# Altium schematic sheet BLDC-CONNECTORS.SchDoc
size 420 x 297 mm; DocumentNumber: АБВГ.000000.000 Э3; SheetNumber: 5; PageSetup: Record=PageOptions|CenterHorizontal=False|CenterVertical=False|PrintScale=0.95|XCorrection=0.00|YCorrection=0.00|PrintKind=1|BorderSize=5000000|LeftOffset=0|BottomOffset=0|Orientation=1|PaperLength=1000|PaperWidth=1000|Scale=100|PaperSource=15|PrintQuality=600|MediaType=1|DitherType=10|PaperKind=A4|PrintScaleMode=1; Letter1Column: {}; Letter2Column: {}; Letter3Column: {}; ProcessInspection: ProcessInspection; EngineerName: EngineerName; NormInspection: NormInspection; DocumentType: DocumentType; Mass: Mass; Scale: Scale; Developer1size1str: Developer1size1str; Developer2size1str: Developer2size1str; Developer2size2str: Developer2size2str; Title1size1str: Title1size1str; Title2size1str: Title2size1str; Title2size2str: Title2size2str; Title3size3str: Title3size3str; Title3size2str: Title3size2str; Title3size1str: Title3size1str; FunctionalGroup: #_
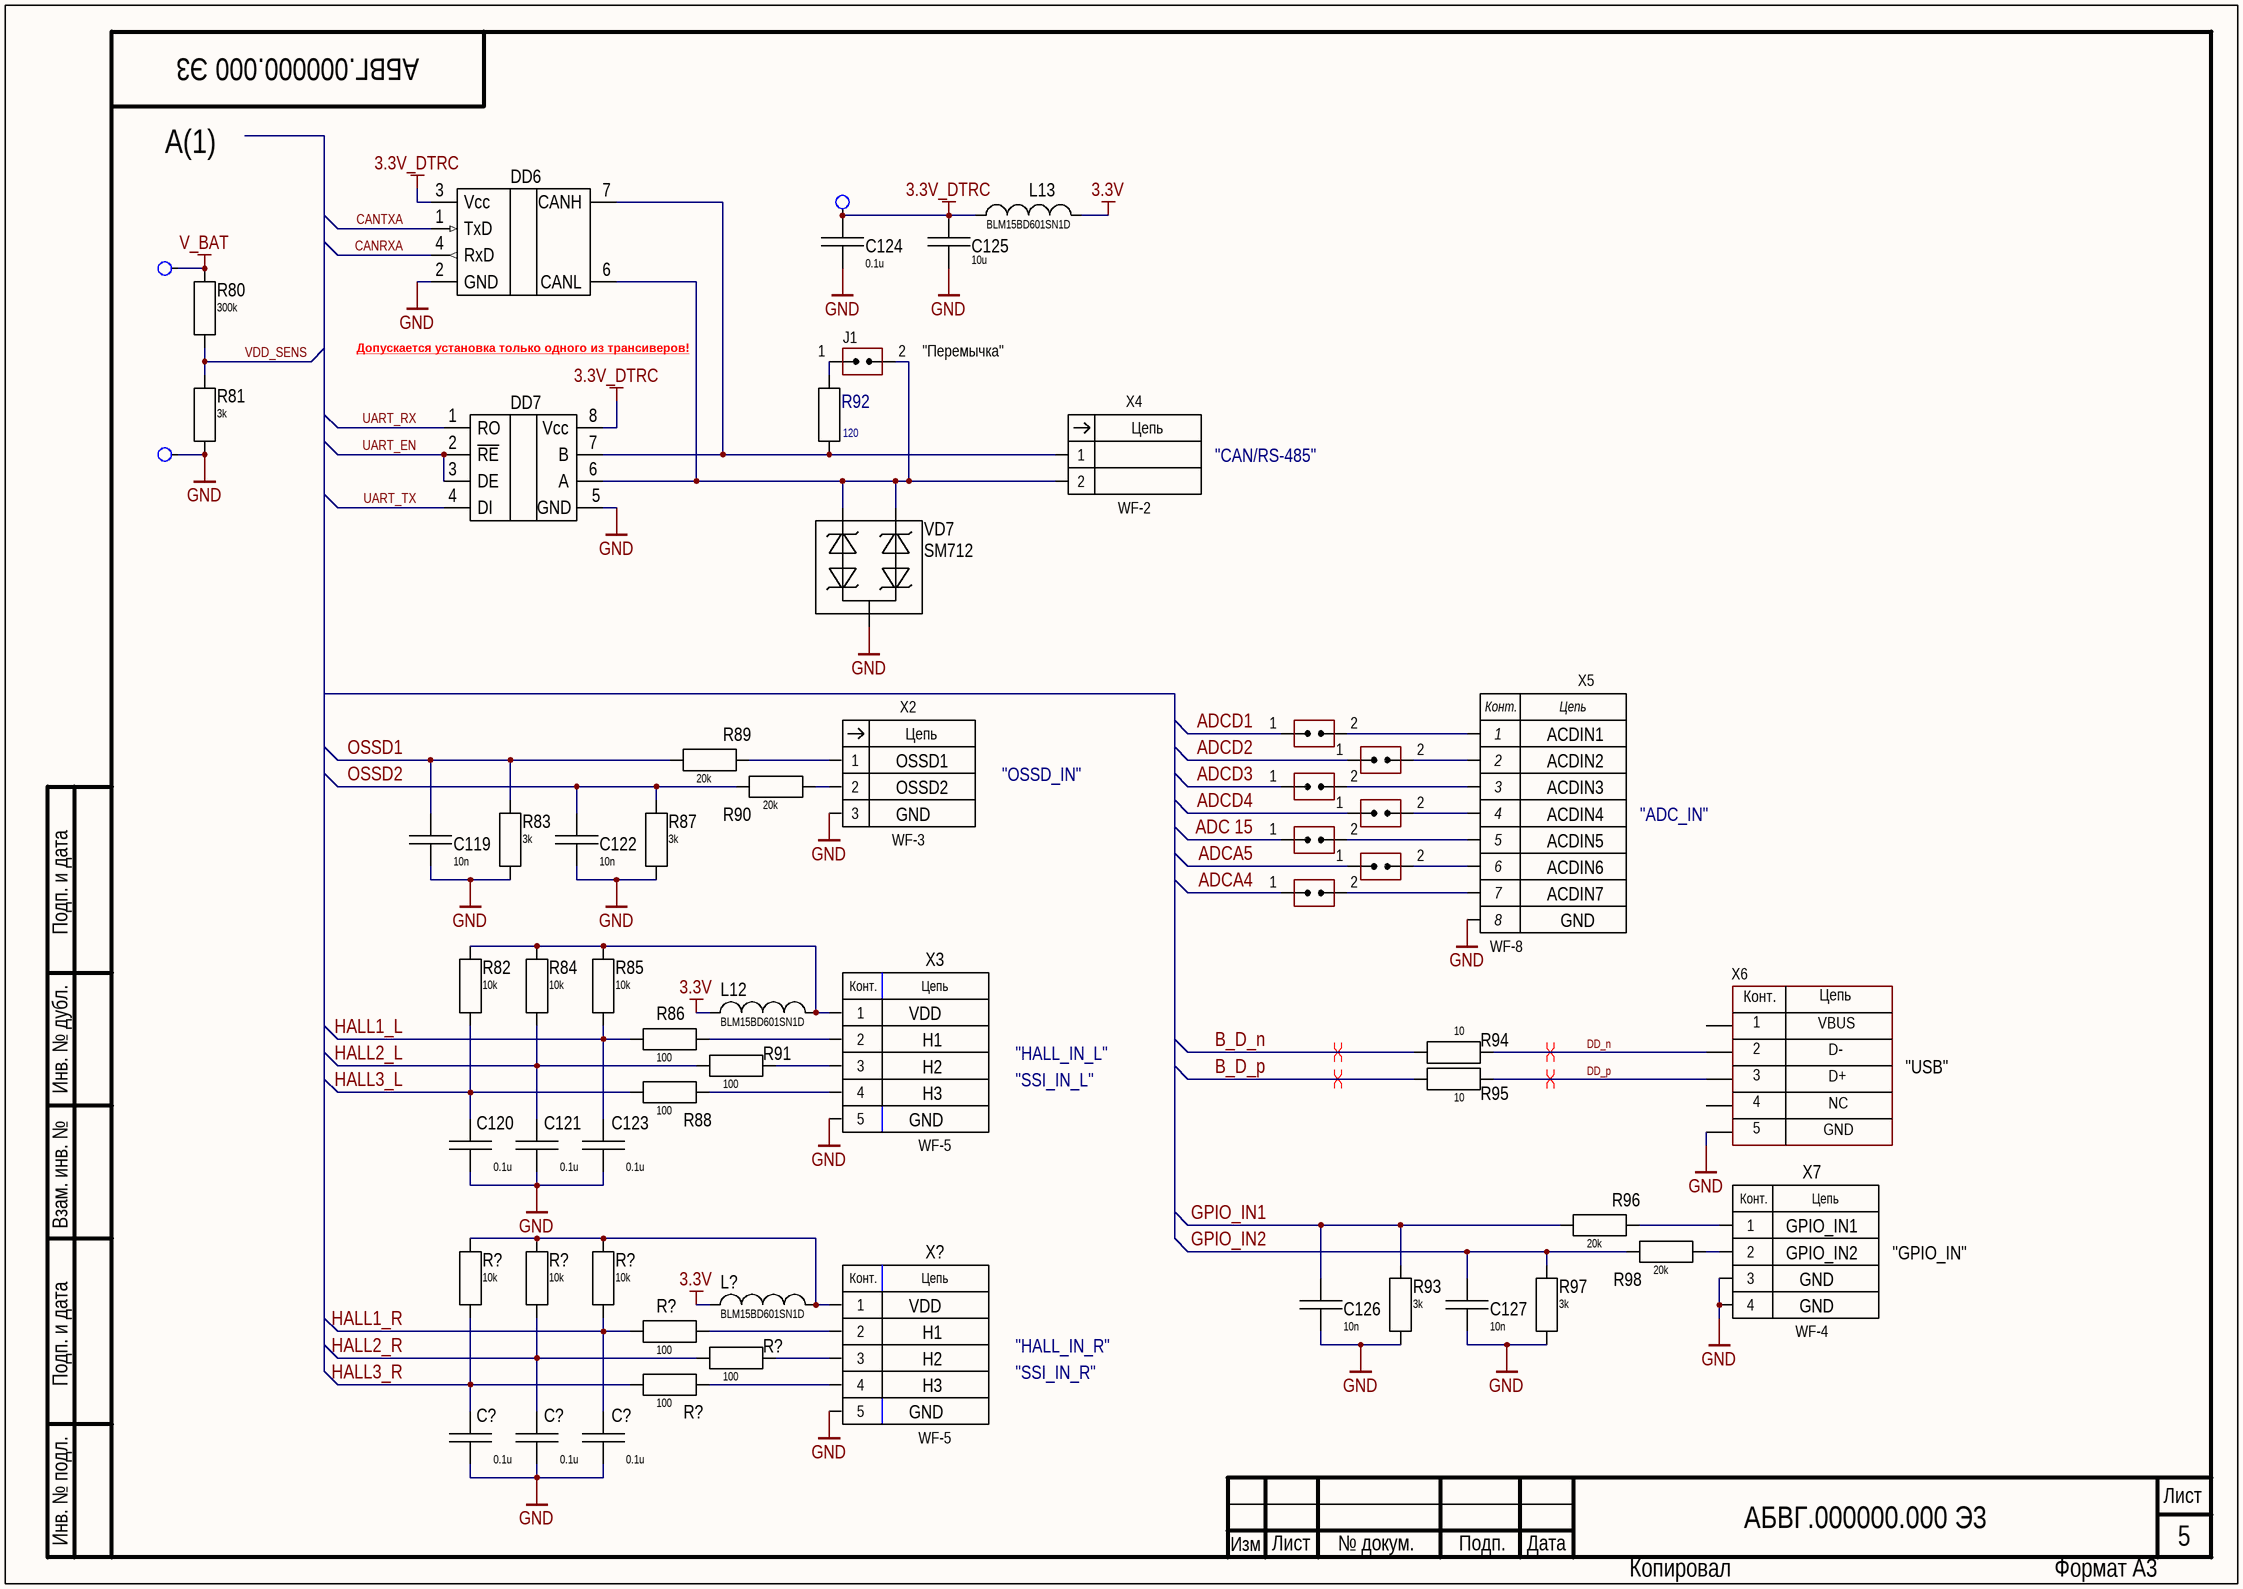
[diagram p0: BLDC-CONNECTORS.SchDoc]

## Parts
(Parts that share a designator on the sheet are numbered #1, #2 ... from top to bottom, then left to right.)
C119  10n  [CAP: 0402]
C120  0.1u  [CAP: 0402]
C121  0.1u  [CAP: 0402]
C122  10n  [CAP: 0402]
C123  0.1u  [CAP: 0402]
C124  0.1u  [CAP: 0402]
C125  10u  [CAP: 0402]
C126  10n  [CAP: 0402]
C127  10n  [CAP: 0402]
C?#1  0.1u  [CAP: 0402]
C?#2  0.1u  [CAP: 0402]
C?#3  0.1u  [CAP: 0402]
DD6  SN65HVD232D  [SOIC-8-150-1.27]  (value not drawn)
DD7  SP485EE  [SOIC-8-150-1.27]  (value not drawn)
J1  CommentText: "Перемычка"  [CON: JUMPER x1]
J2  (no value)  [CON: JUMPER x1]
J3  (no value)  [CON: JUMPER x1]
J4  (no value)  [CON: JUMPER x1]
J5  (no value)  [CON: JUMPER x1]
J6  (no value)  [CON: JUMPER x1]
J7  (no value)  [CON: JUMPER x1]
J8  (no value)  [CON: JUMPER x1]
L12  BLM15BD601SN1D  [IND: 0402]
L13  BLM15BD601SN1D  [IND: 0402]
L?  BLM15BD601SN1D  [IND: 0402]
R80  300k  [RES: 0402]
R81  3k  [RES: 0402]
R82  10k  [RES: 0402]
R83  3k  [RES: 0402]
R84  10k  [RES: 0402]
R85  10k  [RES: 0402]
R86  100  [RES: 0402]
R87  3k  [RES: 0402]
R88  100  [RES: 0402]
R89  20k  [RES: 0402]
R90  20k  [RES: 0402]
R91  100  [RES: 0402]
R92  120  [RES: 0603]
R93  3k  [RES: 0402]
R94  10  [RES: 0402]
R95  10  [RES: 0402]
R96  20k  [RES: 0402]
R97  3k  [RES: 0402]
R98  20k  [RES: 0402]
R?#1  10k  [RES: 0402]
R?#2  10k  [RES: 0402]
R?#3  10k  [RES: 0402]
R?#4  100  [RES: 0402]
R?#5  100  [RES: 0402]
R?#6  100  [RES: 0402]
T7  TestPoint PWR  [TEST_VIA_1.5x0.9mm]  (value not drawn)
T8  TestPoint PWR  [TEST_VIA_1.5x0.9mm]  (value not drawn)
T9  TestPoint Ring  [TestPoint Ring]  (value not drawn)
VD7  SM712  [SOT-23-3]
X2  WF-3  [WF-3]
X3  WF-5  [WF-5]
X4  WF-2  [WF-2]
X5  WF-8  [WF-8]
X6  CommentText: "USB"  [CON: 0675031020]
X7  WF-4  [WF-4]
X?  WF-5  [WF-5]

## Nets
3.3V: L12.2 L13.2 L?.2
3.3V_DTRC: C124.2 C125.2 DD6.3(Vcc) DD7.8(Vcc) L13.1 T9.1(T)
GND: C119.1 C120.1 C121.1 C122.1 C123.1 C124.1 C125.1 C126.1 C127.1 C?#1.1 C?#2.1 C?#3.1 DD6.2(GND) DD7.5(GND) R81.2 R83.2 R87.2 R93.2 R97.2 T8.1(T) VD7.3 X2.3 X3.5 X5.8 X6.5 X7.3 X7.4 X?.5
V_BAT: R80.1 T7.1(T)
ADC 15: J4.1(IN)
ADCA4: J5.1(IN)
ADCA5: J8.1(IN)
ADCD1: J2.1(IN)
ADCD2: J6.1(IN)
ADCD3: J3.1(IN)
ADCD4: J7.1(IN)
B_D_n: R94.1
B_D_p: R95.1
CANRXA: DD6.4(RxD)
CANTXA: DD6.1(TxD)
DD_n: R94.2 X6.2
DD_p: R95.2 X6.3
GPIO_IN1: C126.2 R93.1 R96.2
GPIO_IN2: C127.2 R97.1 R98.2
HALL1_L: C123.2 R85.2 R86.2
HALL1_R: C?#3.2 R?#3.2 R?#4.2
HALL2_L: C121.2 R84.2 R91.2
HALL2_R: C?#2.2 R?#2.2 R?#5.2
HALL3_L: C120.2 R82.2 R88.2
HALL3_R: C?#1.2 R?#1.2 R?#6.2
OSSD1: C119.2 R83.1 R89.2
OSSD2: C122.2 R87.1 R90.2
UART_EN: DD7.2(~{RE}) DD7.3(DE)
UART_RX: DD7.1(RO)
UART_TX: DD7.4(DI)
VDD_SENS: R80.2 R81.1
NetDD6_6: DD6.6(CANL) DD7.6(A) J1.2(IN) VD7.1 VD7.2 X4.2
NetDD6_7: DD6.7(CANH) DD7.7(B) R92.1 X4.1
NetJ1_1: J1.1(IN) R92.2
NetJ2_2: J2.2(IN) X5.1
NetJ3_2: J3.2(IN) X5.3
NetJ4_2: J4.2(IN) X5.5
NetJ5_2: J5.2(IN) X5.7
NetJ6_2: J6.2(IN) X5.2
NetJ7_2: J7.2(IN) X5.4
NetJ8_2: J8.2(IN) X5.6
NetL12_1: L12.1 R82.1 R84.1 R85.1 X3.1
NetL?_1: L?.1 R?#1.1 R?#2.1 R?#3.1 X?.1
NetR86_1: R86.1 X3.2
NetR88_1: R88.1 X3.4
NetR89_1: R89.1 X2.1
NetR90_1: R90.1 X2.2
NetR91_1: R91.1 X3.3
NetR96_1: R96.1 X7.1
NetR98_1: R98.1 X7.2
NetR?#4_1: R?#4.1 X?.2
NetR?#5_1: R?#5.1 X?.3
NetR?#6_1: R?#6.1 X?.4

Not connected (* = marked no-connect by the designer): X6 1 4

## Layout directives
differential pair: B_D_n, B_D_p, DD_n, DD_p

## Notes on the sheet
- А(1)
- Допускается установка только одного из трансиверов!
- "CAN/RS-485"
- OSSD2
- OSSD1
- "OSSD_IN"
- ACDIN3
- ACDIN2
- ACDIN1
- GND
- ACDIN5
- ACDIN4
- "ADC_IN"
- ACDIN7
- ACDIN6
- VDD
- H1
- "HALL_IN_L"
- H2
- H3
- "SSI_IN_L"
- (near X7) GPIO_IN2
- (near X7) GPIO_IN1
- "GPIO_IN"
- "HALL_IN_R"
- "SSI_IN_R"
- Подп. и дата
- Инв. № дубл.
- Взам. инв. №
- Инв. № подл.
- Лист
- Изм
- № докум.
- Подп.
- Дата
- Копировал
- Формат А3
- (in symbol Connector_USB_mini_B) Цепь; Конт.; VBUS; D-; D+; NC; GND
- (in symbol WF-2) Цепь
- (in symbol WF-3) Цепь
- (in symbol WF-4_T) Конт.; Цепь
- (in symbol WF-5) Конт.; Цепь
- (in symbol WF-8) Конт.; Цепь

## Library data of the parts
C119-C124 C126 C127 C?#1-C?#3 = CAP 0402: PartNumber: C0402C104K8PAC; Manufacturer: Kemet; Voltage: 10V; Type: Capacitor; Temperature_Range: -55/+85; Tolerance: 10%; Case: 0402
  C119 C122 C126 C127: Value: 10n
  C120 C121 C123 C124 C?#1-C?#3: Value: 0.1u
C125 = CAP 0402: PartNumber: CC0402MRX5R5BB106; Voltage: 6.3V; Value: 10u
J1 = Jumper_single
J2-J8 = Jumper_single: CommentText: "Перемычка"
R80-R91 R93 R96-R98 R?#1-R?#6 = RES 0402: Tolerance: 1%; PartNumber: *
  R80: Value: 300k
  R81 R83 R87 R93 R97: Value: 3k
  R82 R84 R85 R?#1-R?#3: Value: 10k
  R86 R88 R91 R?#4-R?#6: Value: 100
  R89 R90 R96 R98: Value: 20k
R92 = RES 0603: PartNumber: CRCW0603120RFKEAHP; Value: 120
R94 R95 = RES 0402: PartNumber: RC0402FR-0710RL; Tolerance: 1%; Value: 10; Manufacturer: *; Type: Resistor; Temperature_Range: *; Composition: *; Voltage: *; Case: 0402
VD7 = SM712: PartNumber: SM712-02HTG
X2 = WF-3: PartNumber: Вилка WF-3 «Zhenqin»; Value: *
X3 X? = WF-5: PartNumber: Вилка WF-5 «Zhenqin»; Value: *
X4 = WF-2: PartNumber: Вилка WF-2 «Zhenqin»; Value: *
X5 = WF-8: PartNumber: Вилка WF-8 «Zhenqin»; Value: *
X6 = Connector_USB_mini_B: Manufacturer: Molex; ValueManufacturerPartNumber: USB mini B; PartNumber: 0675031020; HelpURL: https://www.digikey.com/product-detail/en/molex/0675031020/WM5461CT-ND/1624427; TypeConnector: USB mini B
X7 = WF-4_T: Value: *
L12 L13 L? = BLM15BD601SN1D: PartNumber: BLM15BD601SN1D